# Altium schematic sheet 2015-01-31_17-57-461.schdoc
size 227 x 139 mm; SheetNumber: 1; SheetTotal: 1
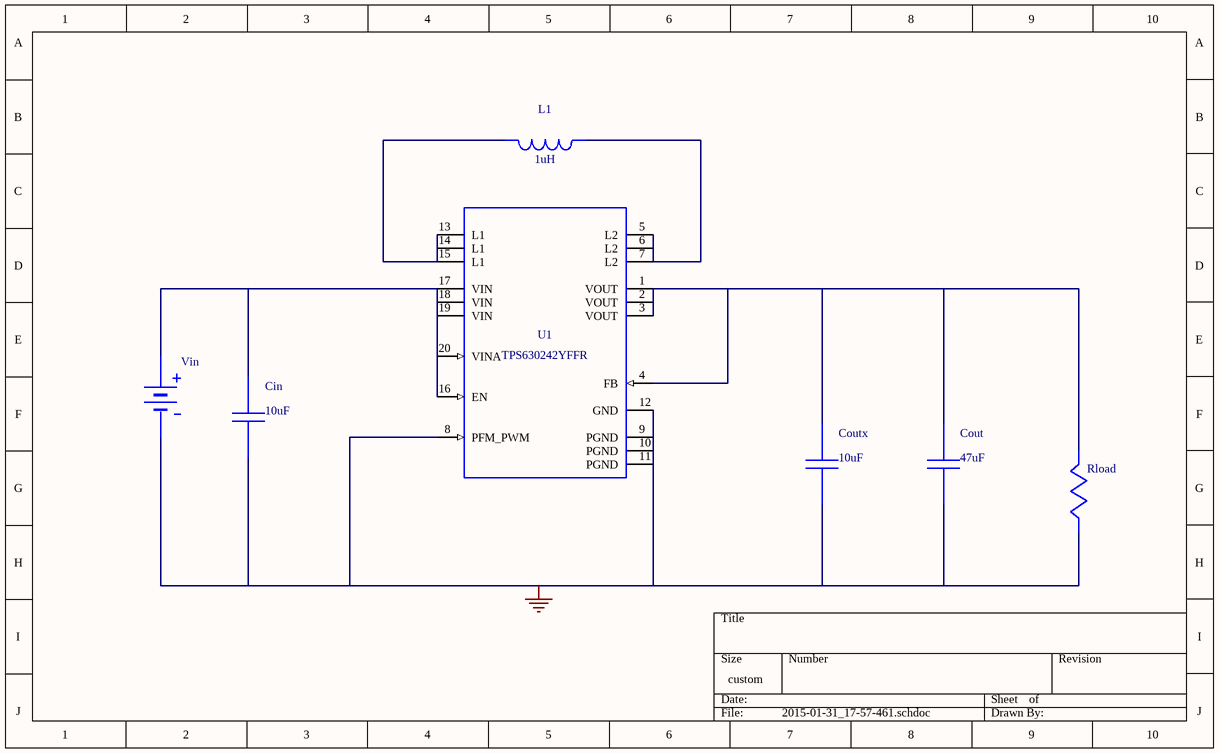
[diagram p0: 2015-01-31_17-57-461.schdoc]

## Parts
Cin  value 10uF  (hidden comment: CL10A106MQ8NNNC)
Cout  value 47uF  (hidden comment: JMK212BJ476MG-T)
Coutx  value 10uF  (hidden comment: CL10A106MQ8NNNC)
L1  value 1uH  (hidden comment: IHLP1212BZER1R0M11)
Rload  WB_LOAD_RESISTOR  (value not drawn)
U1  TPS630242YFFR
Vin  WB_BATTERY  (value not drawn)

## Nets
0: Cin.2 Cout.2 Coutx.2 Rload.2 U1.8(PFM_PWM) U1.9(PGND) U1.10(PGND) U1.11(PGND) U1.12(GND) Vin.2(-)
NetCin_1: Cin.1 U1.16(EN) U1.17(VIN) U1.18(VIN) U1.19(VIN) U1.20(VINA) Vin.1(+)
NetCout_1: Cout.1 Coutx.1 Rload.1 U1.1(VOUT) U1.2(VOUT) U1.3(VOUT) U1.4(FB)
NetL1_1: L1.1 U1.13(L1) U1.14(L1) U1.15(L1)
NetL1_2: L1.2 U1.5(L2) U1.6(L2) U1.7(L2)

## Library data of the parts
Cin Coutx = CL10A106MQ8NNNC: Manufacturer Name: Samsung Electro-Mechanics; PackageReference: CL10A106MQ8NNNC; Manufacturer Part Number: CL10A106MQ8NNNC
Cout = JMK212BJ476MG-T: Manufacturer Name: Taiyo Yuden; PackageReference: JMK212BJ476MG-T; Manufacturer Part Number: JMK212BJ476MG-T
L1 = IHLP1212BZER1R0M11: Unknown; Manufacturer Name: Vishay-Dale; PackageReference: IHLP1212BZER1R0M11; Manufacturer Part Number: IHLP1212BZER1R0M11
Rload = WB_LOAD_RESISTOR: Value: UNLISTED; PackageReference: WB_LOAD_RESISTOR; Manufacturer Part Number: WB_LOAD_RESISTOR; Manufacturer Name: WB_LOAD_RESISTOR
U1 = TPS630242YFFR: Manufacturer Name: Texas Instruments; Value: UNLISTED; PackageReference: TPS630242YFFR; Manufacturer Part Number: TPS630242YFFR
Vin = WB_BATTERY: Value: UNLISTED; PackageReference: WB_BATTERY; Manufacturer Part Number: WB_BATTERY; Manufacturer Name: WB_BATTERY